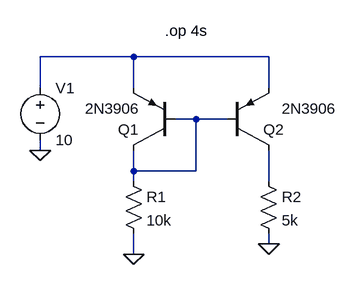
[diagram p0: schematic current-source.asc]
current-source.asc, the LTspice schematic file:
Version 4
SHEET 1 880 680
WIRE -464 176 -608 176
WIRE -256 176 -464 176
WIRE -608 224 -608 176
WIRE -464 224 -464 176
WIRE -256 224 -256 176
WIRE -368 272 -400 272
WIRE -320 272 -368 272
WIRE -608 320 -608 304
WIRE -464 352 -464 320
WIRE -368 352 -368 272
WIRE -368 352 -464 352
WIRE -464 368 -464 352
WIRE -256 368 -256 320
WIRE -256 464 -256 448
WIRE -464 480 -464 448
FLAG -464 480 0
FLAG -256 464 0
FLAG -608 320 0
DATAFLAG -256 352 "$"
DATAFLAG -384 352 "$"
DATAFLAG -288 176 "$"
SYMBOL pnp -400 320 R180
WINDOW 3 54 64 Left 2
SYMATTR Value 2N3906
SYMATTR InstName Q1
SYMBOL pnp -320 320 M180
WINDOW 3 84 64 Left 2
SYMATTR Value 2N3906
SYMATTR InstName Q2
SYMBOL res -480 352 R0
SYMATTR InstName R1
SYMATTR Value 10k
SYMBOL res -272 352 R0
SYMATTR InstName R2
SYMATTR Value 5k
SYMBOL voltage -608 208 R0
SYMATTR InstName V1
SYMATTR Value 10
TEXT -416 136 Left 2 !.op 4s

The netlist it stands for:
* current-source.asc
Q1 N002 N002 N001 0 2N3906
Q2 N003 N002 N001 0 2N3906
R1 N002 0 10k
R2 N003 0 5k
V1 N001 0 10
.model NPN NPN
.model PNP PNP
.lib standard.bjt
.op 4s
.backanno
.end